# EAGLE design Supply (EAGLE 6.2)
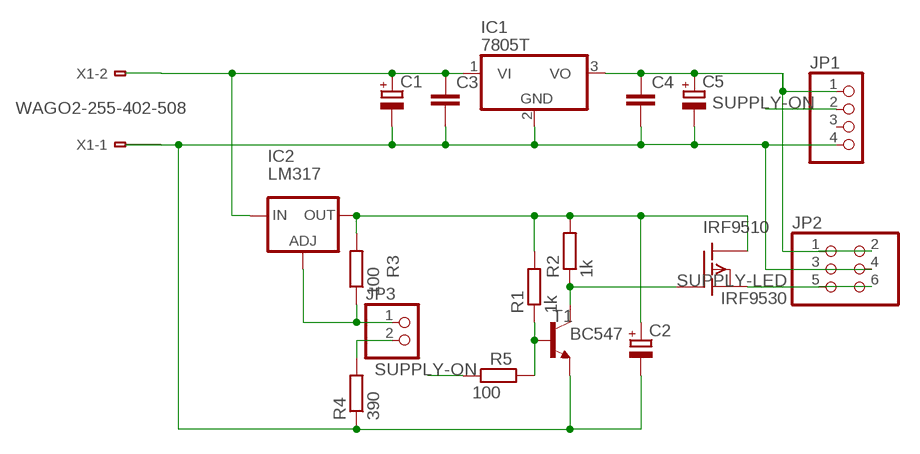
[diagram p0: schematic, sheet 1]

## Parts
C1  CPOL-EUE5-10.5  [E5-10,5]
C2  CPOL-EUE5-10.5  [E5-10,5]
C3  C-EU050-024X044  [C050-024X044]
C4  C-EU050-024X044  [C050-024X044]
C5  CPOL-EUE2,5-6E  [E2,5-6E]
IC1  7805T  [TO220H]
IC2  LM317  LM317TL  [317TL]
IRF9510  IRF9530  [TO220]
JP1  PINHD-1X4  [1X04]
JP2  PINHD-2X3  [2X03]
JP3  PINHD-1X2  [1X02]
R1  1k  R-EU_0207/7  [0207/7]
R2  1k  R-EU_0207/7  [0207/7]
R3  100  R-EU_0207/7  [0207/7]
R4  390  R-EU_0207/7  [0207/7]
R5  100  R-EU_0207/7  [0207/7]
T1  BC547  BC547-NPN-TO92-CBE  [TO92-CBE]
X1  WAGO2-255-402-508  [255-402-508]

## Nets
N$1 [PWR]: C1.+ C3.1 IC1.1(VI) IC2.3(IN) X1.B2(-2:B1)
N$2: IC2.1(ADJ) JP3.1 R3.1
N$3: C4.1 C5.+ IC1.3(VO) JP1.1 JP2.1 JP2.2
N$4: R1.1 R5.2 T1.B
N$5: C1.- C2.- C3.2 C4.2 C5.- IC1.2(GND) JP1.4 JP2.3 JP2.4 R4.1 T1.E X1.B1(-1:B1)
N$10: IRF9510.1(G) R2.1 T1.C
N$11: C2.+ IC2.2(OUT) IRF9510.2(D) R1.2 R2.2 R3.2
N$15: JP3.2 R4.2
SUPPLY-LED: IRF9510.3(S) JP2.5 JP2.6
SUPPLY-ON: JP1.2 R5.1
Unconnected: JP1.3 X1.A1(-1:A1) X1.A2(-2:A1)

## Library data of the parts
C1 C2 C5 = rcl:CPOL-EU: POLARIZED CAPACITOR, European symbol
C3 C4 = rcl:C-EU: CAPACITOR, European symbol
IC1 = linear:78*: Positive VOLTAGE REGULATOR Source: http://cache.national.com/ds/LM/LM78L05.pdf http://www.fairchildsemi.com/ds/LM/LM7805.pdf
IC2 = v-reg:LM317TL: VOLTAGE REGULATOR
IRF9510 = transistor-fet:IRF9530: P-Channel Enhancement MOSFET (HEXFET); -100V; -12A; 0,3Ohm
JP1 = pinhead:PINHD-1X4: PIN HEADER
JP2 = pinhead:PINHD-2X3: PIN HEADER
JP3 = pinhead:PINHD-1X2: PIN HEADER
R1-R5 = rcl:R-EU_: RESISTOR, European symbol
T1 = transistor:*-NPN-: NPN Transistror BF959 corrected 2008.03.06
X1 = con-wago:WAGO2-: WAGO Cage Clamp; OC_FARNELL: unknown; OC_NEWARK: unknown

## Net classes
1 PWR: width 1.905 mm

## Board
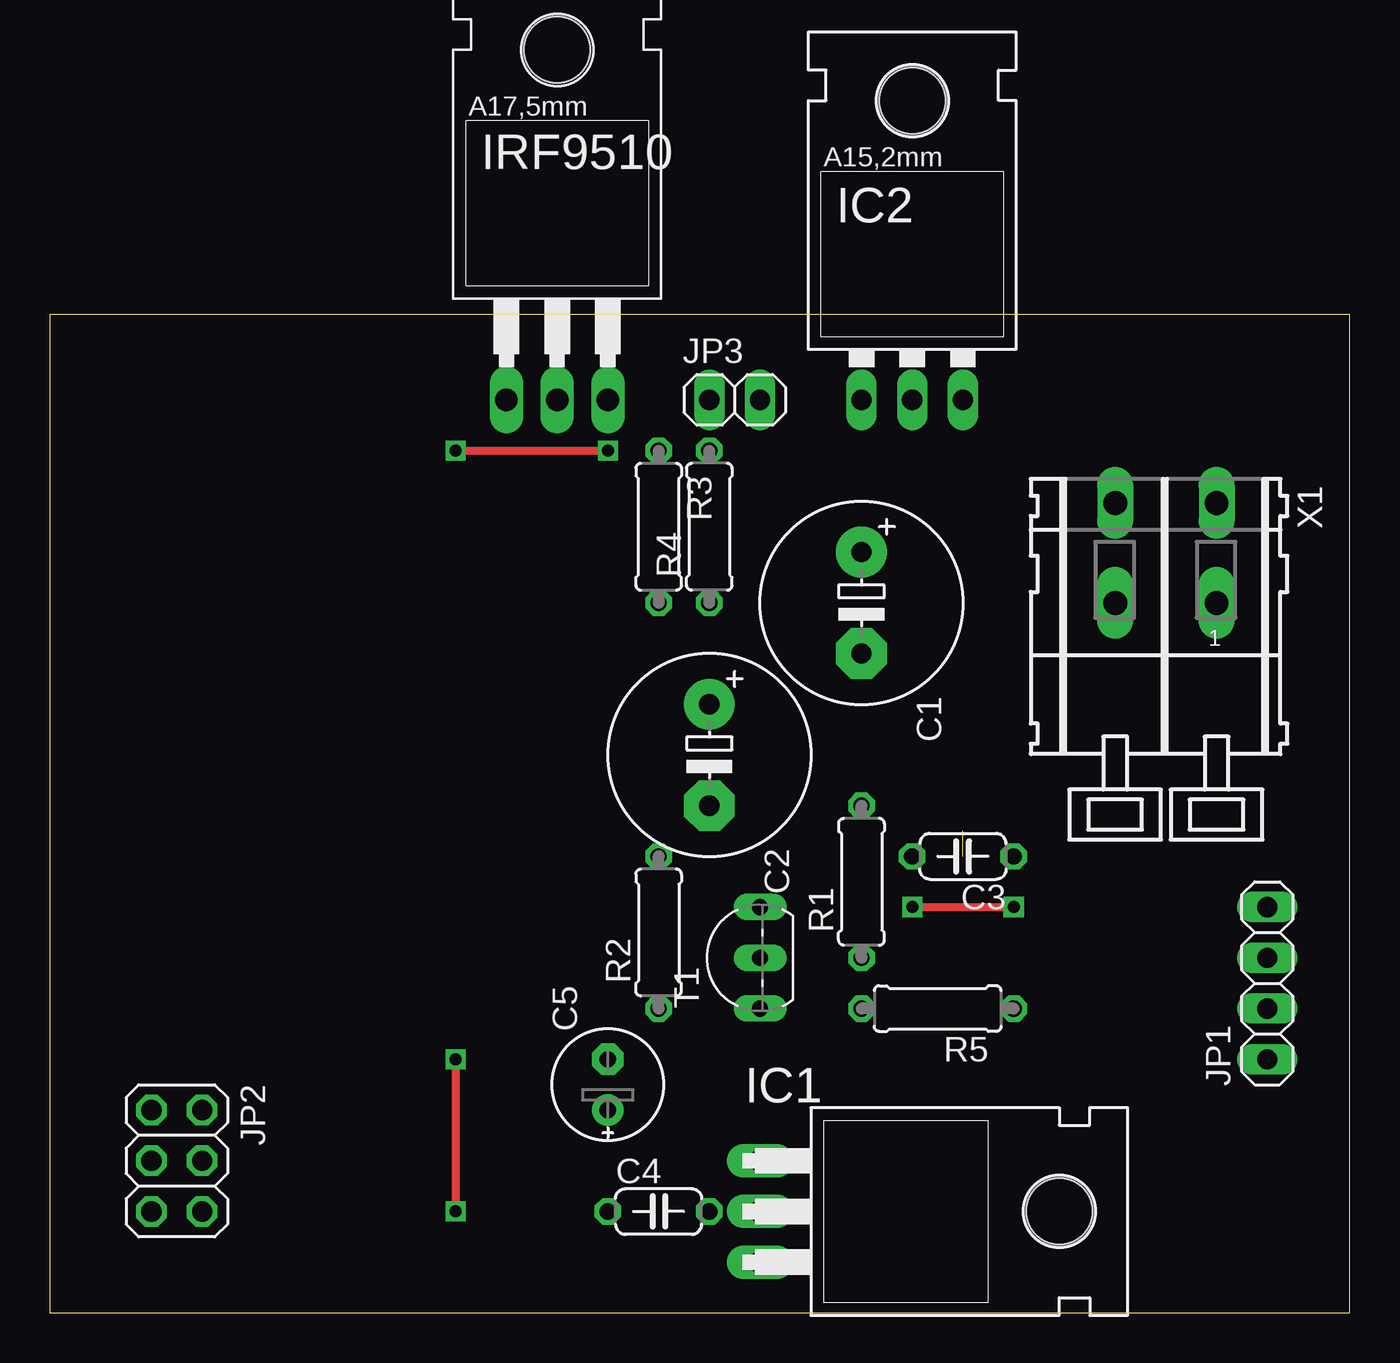
[diagram p1: board, top side]
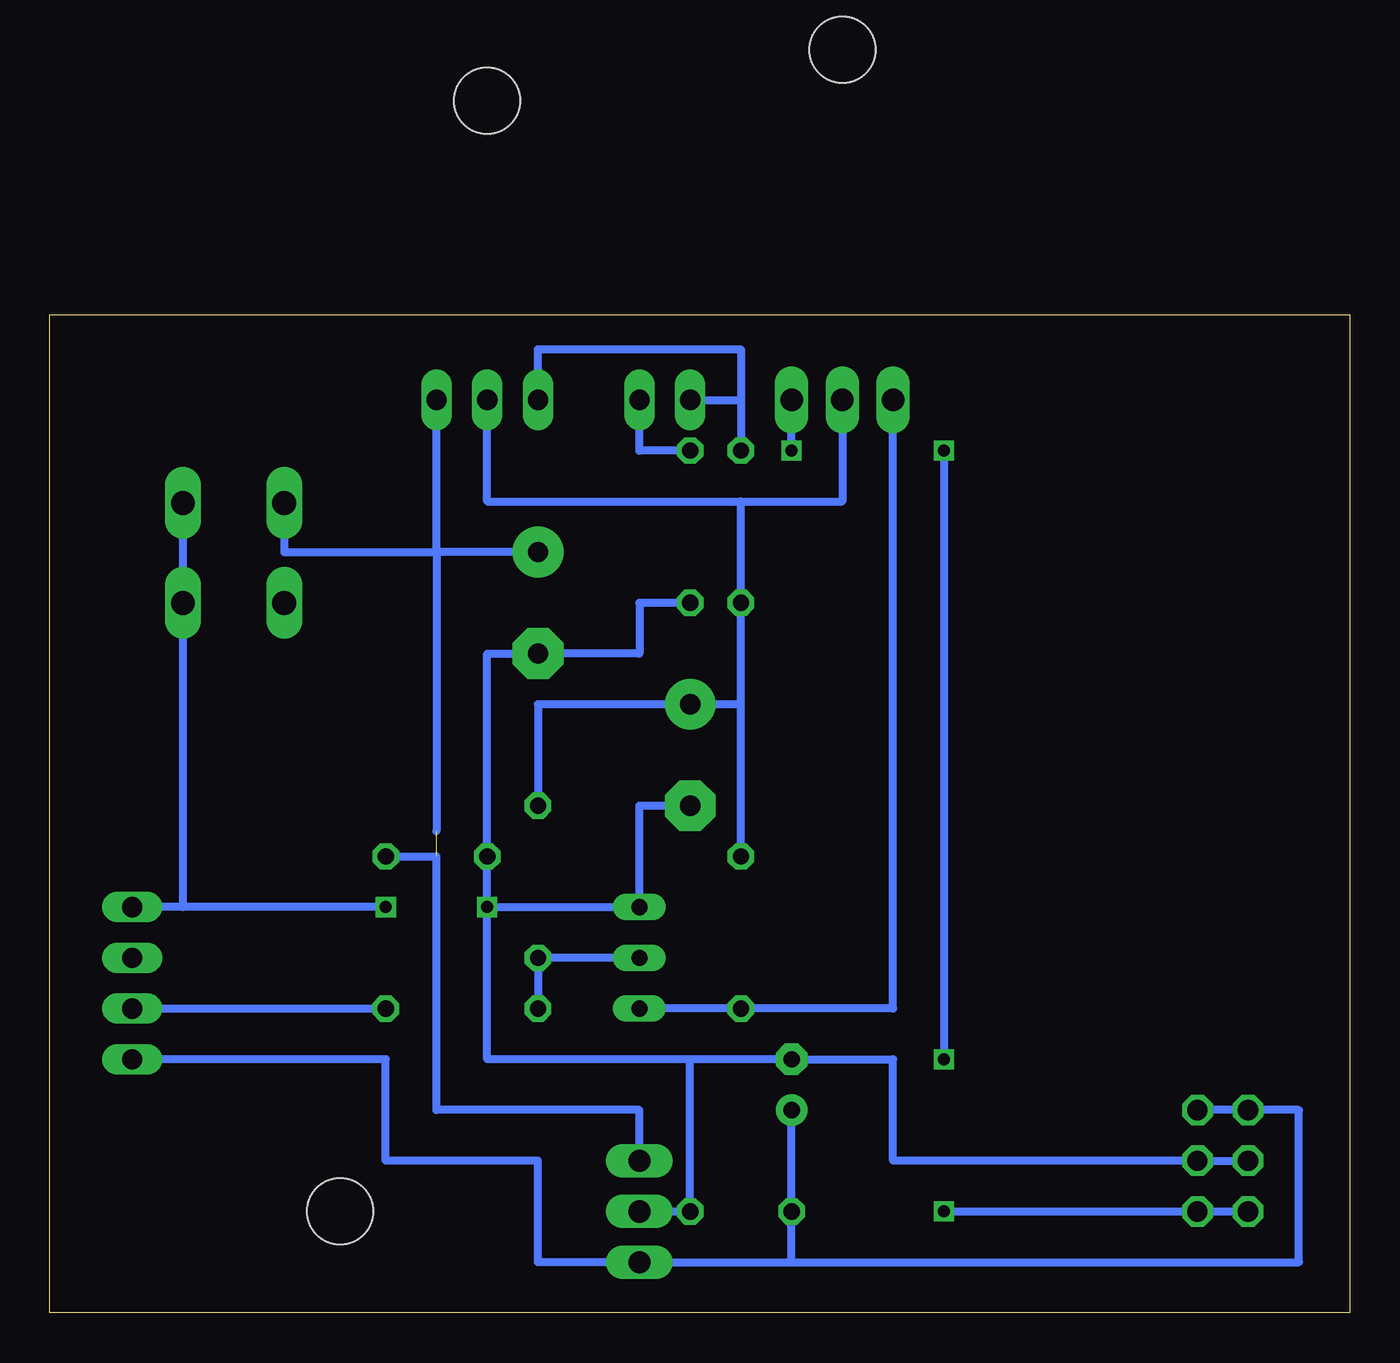
[diagram p2: board, bottom side, seen from below]

Size 65.08 x 50 mm. Coordinates in mm from the lower left corner, seen from the top.
Outline: 0,0 65.08,0 65.08,50 0,50 0,0
Copper layers (1*16): Top 0.035mm / dielectric 1.5mm / Bottom 0.035mm
Design rules: minimum track width 10mil, minimum drill 24mil, track to track 6mil, track to pad 8mil, pad to pad 6mil, via to via 6mil, smd to smd 8mil, copper to edge 30mil, drill to drill 8mil, minimum pad ring 10mil, minimum via ring 8mil, stop-mask expansion 4mil, vias tented up to drill 0mil, thermal gap 10mil

### Footprints (pad centres in the part's own frame; a part is rotated, then mirrored left to right if it is on the bottom)
E5-10,5 = drill 1.016 pad 2.54: + -2.54,0 | drill 1.016 pad 2.54 octagon: - 2.54,0
C050-024X044 = drill 0.813 octagon: 1 -2.54,0; 2 2.54,0
E2,5-6E = drill 0.813 pad 1.575: + -1.27,0 | drill 0.813 pad 1.575 octagon: - 1.27,0
TO220H = drill 1.118 long: 1 -2.54,-10.16; 2 0,-10.16; 3 2.54,-10.16 | hole 3.302: 0,4.826
317TL = drill 1.016 long: 1 -2.54,-3.81; 2 0,-3.81; 3 2.54,-3.81 | hole 3.302: 0,11.176
TO220 = drill 1.118 long: 1 -2.54,-6.35; 2 0,-6.35; 3 2.54,-6.35 | hole 3.302: 0,11.176
1X04 = drill 1.016 long: 1 -3.81,0; 2 -1.27,0; 3 1.27,0; 4 3.81,0
2X03 = drill 1.016 octagon: 1 -2.54,-1.27; 2 -2.54,1.27; 3 0,-1.27; 4 0,1.27; 5 2.54,-1.27; 6 2.54,1.27
1X02 = drill 1.016 long: 1 -1.27,0; 2 1.27,0
0207/7 = drill 0.813 octagon: 1 -3.81,0; 2 3.81,0
TO92-CBE = drill 0.813 long: B 0,0; C -2.54,0; E 2.54,0
255-402-508 = drill 1.2 long: A1 -2.54,0; A2 2.54,0; B1 -2.54,-5; B2 2.54,-5

### Placement (x,y rotation side)
C1  40.64,35.56 270 top
C2  33.02,27.94 270 top
C3  45.72,22.86 180 top
C4  30.48,5.08 0 top
C5  27.94,11.43 90 top
IC1  45.72,5.08 270 top
IC2  43.18,49.53 0 top
IRF9510  25.4,52.07 0 top
JP1  60.96,16.51 90 top
JP2  6.35,7.62 270 top
JP3  34.29,45.72 0 top
R1  40.64,21.59 90 top
R2  30.48,19.05 90 top
R3  30.48,39.37 270 top
R4  33.02,39.37 90 top
R5  44.45,15.24 180 top
T1  35.56,17.78 90 top
X1  55.88,35.56 180 top

### Tracks (layer width: path | path; a pad name or v marks a point on that pad's centre or on a via)
N$1  (1 unrouted)
  Bottom 0.406: C3.1 45.72,22.86 45.72,10.16 35.56,10.16 IC1.1 | C1.+ 45.72,38.1 | 45.72,38.1 IC2.3 | 45.72,38.1 45.72,24.13 | X1.B2 53.34,38.1 45.72,38.1
N$2
  Bottom 0.406: IC2.1 40.64,48.26 30.48,48.26 30.48,45.72 | 30.48,45.72 R3.1 | JP3.1 30.48,45.72
N$3
  Bottom 0.406: 27.94,2.54 2.54,2.54 2.54,10.16 JP2.1 JP2.2 | 27.94,2.54 IC1.3 40.64,2.54 40.64,7.62 48.26,7.62 48.26,12.7 JP1.1 | 27.94,2.54 C4.1 C5.+
N$4
  Bottom 0.406: R5.2 R1.1 T1.B
N$5  (via drill 0.6)
  Top 0.406: v43.18,20.32 v48.26,20.32
  Bottom 0.406: v48.26,20.32 58.42,20.32 | v43.18,20.32 C3.2 43.18,33.02 C1.- 35.56,33.02 35.56,35.56 R4.1 | v43.18,20.32 T1.E 35.56,25.4 C2.- | v43.18,20.32 43.18,12.7 33.02,12.7 | IC1.2 C4.2 33.02,12.7 | JP2.3 JP2.4 22.86,7.62 22.86,12.7 C5.- 33.02,12.7 | X1.B1 58.42,20.32 | 58.42,20.32 JP1.4
N$10
  Bottom 0.406: T1.C R2.1 22.86,15.24 IRF9510.1
N$11
  Bottom 0.406: R1.2 40.64,30.48 C2.+ 30.48,30.48 | R2.2 30.48,30.48 | 30.48,30.48 R3.2 30.48,40.64 | IC2.2 43.18,40.64 30.48,40.64 | IRF9510.2 25.4,40.64 30.48,40.64
N$15
  Bottom 0.406: R4.2 35.56,43.18 JP3.2
SUPPLY-LED  (via drill 0.6)
  Top 0.406: v20.32,43.18 v27.94,43.18 | v20.32,12.7 v20.32,5.08
  Bottom 0.406: v27.94,43.18 IRF9510.3 | v20.32,43.18 v20.32,12.7 | v20.32,5.08 JP2.6 JP2.5
SUPPLY-ON
  Bottom 0.406: JP1.2 R5.1